# Altium schematic sheet Cygnal.SchDoc
size A4
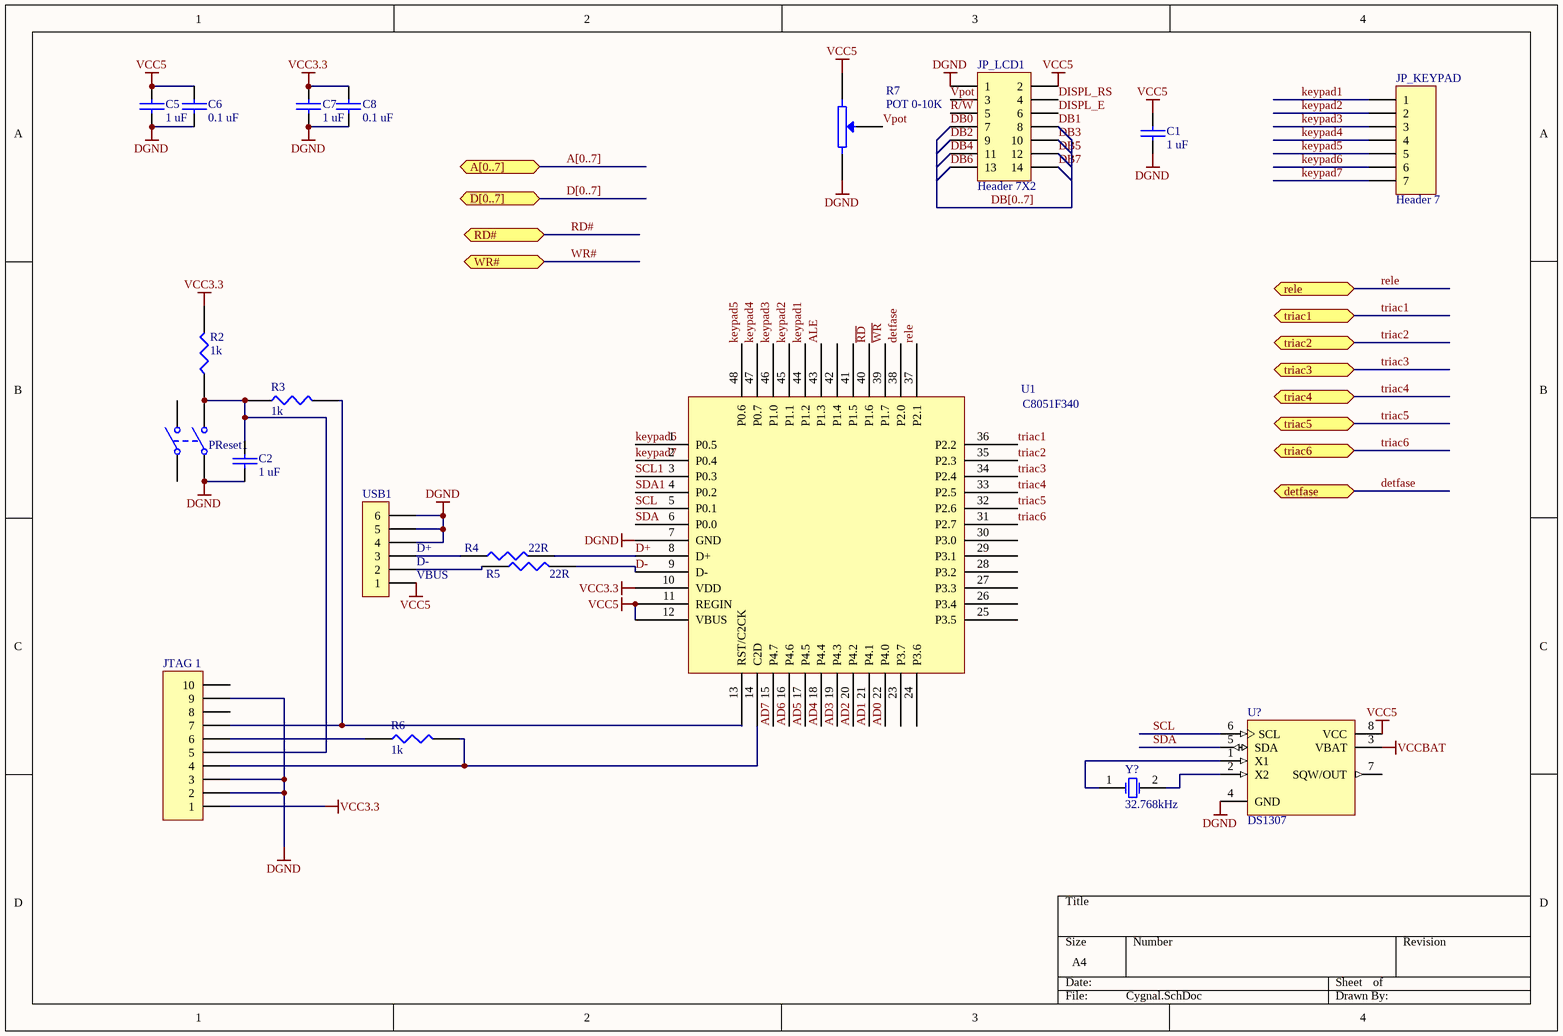
[diagram p0: Cygnal.SchDoc]

## Parts
C1  1 uF  [CAP 10]
C2  1 uF  [CAP 10]
C5  1 uF  [CAP 10]
C6  0.1 uF  [CAP 10]
C7  1 uF  [CAP 10]
C8  0.1 uF  [CAP 10]
JP_KEYPAD  Header 7  [HDR1X7]
JP_LCD1  Header 7X2  [HDR2X7]
JTAG_1  (no value)  [IDC-10]
PReset1  SW-DPST  [Pulsador]  (value not drawn)
R2  1k  [1608[0603]]
R3  1k  [1608[0603]]
R4  22R  [1608[0603]]
R5  22R  [1608[0603]]
R6  1k  [1608[0603]]
R7  POT 0-10K  [POT]
U1  C8051F340  [TQFP48]
U?  DS1307  [DIP8]
USB1  (no value)  [USB_CON]
Y?  32.768kHz  [R38]

## Ports
A[0..7], D[0..7], detfase, RD#, rele, triac1, triac2, triac3, triac4, triac5, triac6, WR#

## Nets
DGND: C1.2 C2.2 C5.2 C6.2 C7.2 C8.2 JP_LCD1.1 JTAG_1.2 JTAG_1.3 JTAG_1.9 PReset1.3(COMMON2) R7.2 U1.7(GND) U?.4(GND) USB1.4 USB1.5 USB1.6
VCC3.3: C7.1 C8.1 JTAG_1.1 R2.2 U1.10(VDD)
VCC5: C1.1 C5.1 C6.1 JP_LCD1.2 R7.1 U1.11(REGIN) U1.12(VBUS) U?.8(VCC) USB1.1
VCCBAT: U?.3(VBAT)
AD0: U1.22(P4.0)
AD1: U1.21(P4.1)
AD2: U1.20(P4.2)
AD3: U1.19(P4.3)
AD4: U1.18(P4.4)
AD5: U1.17(P4.5)
AD6: U1.16(P4.6)
AD7: U1.15(P4.7)
ALE: U1.43(P1.3)
D+: R4.2 U1.8(D+)
D-: R5.2 U1.9(D-)
DB0: JP_LCD1.7
DB1: JP_LCD1.8
DB2: JP_LCD1.9
DB3: JP_LCD1.10
DB4: JP_LCD1.11
DB5: JP_LCD1.12
DB6: JP_LCD1.13
DB7: JP_LCD1.14
detfase: U1.38(P2.0) ; port detfase
DISPL_E: JP_LCD1.6
DISPL_RS: JP_LCD1.4
keypad1: JP_KEYPAD.1 U1.44(P1.2)
keypad2: JP_KEYPAD.2 U1.45(P1.1)
keypad3: JP_KEYPAD.3 U1.46(P1.0)
keypad4: JP_KEYPAD.4 U1.47(P0.7)
keypad5: JP_KEYPAD.5 U1.48(P0.6)
keypad6: JP_KEYPAD.6 U1.1(P0.5)
keypad7: JP_KEYPAD.7 U1.2(P0.4)
R/~{W}: JP_LCD1.5
~{RD}: U1.40(P1.6)
RD#: port RD#
rele: U1.37(P2.1) ; port rele
SCL: U1.5(P0.1) U?.6(SCL)
SCL1: U1.3(P0.3)
SDA: U1.6(P0.0) U?.5(SDA)
SDA1: U1.4(P0.2)
triac1: U1.36(P2.2) ; port triac1
triac2: U1.35(P2.3) ; port triac2
triac3: U1.34(P2.4) ; port triac3
triac4: U1.33(P2.5) ; port triac4
triac5: U1.32(P2.6) ; port triac5
triac6: U1.31(P2.7) ; port triac6
Vpot: JP_LCD1.3 R7.3
~{WR}: U1.39(P1.7)
WR#: port WR#
NetC2_1: C2.1 JTAG_1.5 PReset1.4(NO2) R2.1 R3.1
NetJTAG_1_4: JTAG_1.4 R6.2 U1.14(C2D)
NetJTAG_1_6: JTAG_1.6 R6.1
NetJTAG_1_7: JTAG_1.7 R3.2 U1.13(RST/C2CK)
NetR4_1: R4.1 USB1.3
NetR5_1: R5.1 USB1.2
NetU?_1: U?.1(X1) Y?.1(OSC1)
NetU?_2: U?.2(X2) Y?.2(OSC2)

Not connected (* = marked no-connect by the designer): JTAG_1 8 10; PReset1 1(COMMON1) 2(NO1); U1 23(P3.7) 24(P3.6) 25(P3.5) 26(P3.4) 27(P3.3) 28(P3.2) 29(P3.1) 30(P3.0) 41(P1.5) 42(P1.4); U? 7(SQW/OUT)

## Buses and harness runs
bus A[0..7] = port A[0..7]
bus D[0..7] = port D[0..7]
bus DB[0..7]

## Notes on the sheet
- (near USB1) VBUS
- (near USB1) D-
- (near USB1) D+

## Library data of the parts
C1 C2 C5-C8 = CAP: Capacitor
JP_KEYPAD = Header 7: Header, 7-Pin; LatestRevisionDate: 17-Jul-2002; LatestRevisionNote: Re-released for DXP Platform.; Publisher: Altium Limited
JP_LCD1 = Header 7X2: Header, 7-Pin, Dual row; LatestRevisionDate: 17-Jul-2002; LatestRevisionNote: Re-released for DXP Platform.; Publisher: Altium Limited
JTAG_1 = CON10: Connector
PReset1 = SW-DPST: Double-Pole, Single-Throw Switch; Manufacturer: Generic Components; Published: 1999
R2-R6 = RES1: =VALUE
R7 = POT2: Potentiometer
U? = DS1307: 64 X 8 Serial Real-Time Clock; Published: 13-Oct-2000; LatestRevisionDate: 06-Jun-2005; LatestRevisionNote: Stylized 3D Model Added.; DatasheetVersion: 10-Aug-1999; PackageVersion: 1999; PackageReference: DIP8; Publisher: Altium Limited; PackageDescription: DIP; 8 Leads; Row Spacing 7.62 mm; Pitch 2.54 mm; ComponentLink1Description: Manufacturer Link; ComponentLink1URL: http://www.maxim-ic.com/; ComponentLink2Description: Datasheet; ComponentLink2URL: http://pdfserv.maxim-ic.com/en/ds/DS1307.pdf; ComponentLink3Description: Discontinuation Notice; ComponentLink3URL: http://www.maxim-ic.com/qa/pdfs/non-obsolescence-letter.pdf
USB1 = CON6: Connector
Y? = XTAL: Crystal Oscillator; Published: 8-Jun-2000; LatestRevisionDate: 17-Jul-2002; LatestRevisionNote: Re-released for DXP Platform.; PackageReference: R38; Publisher: Altium Limited